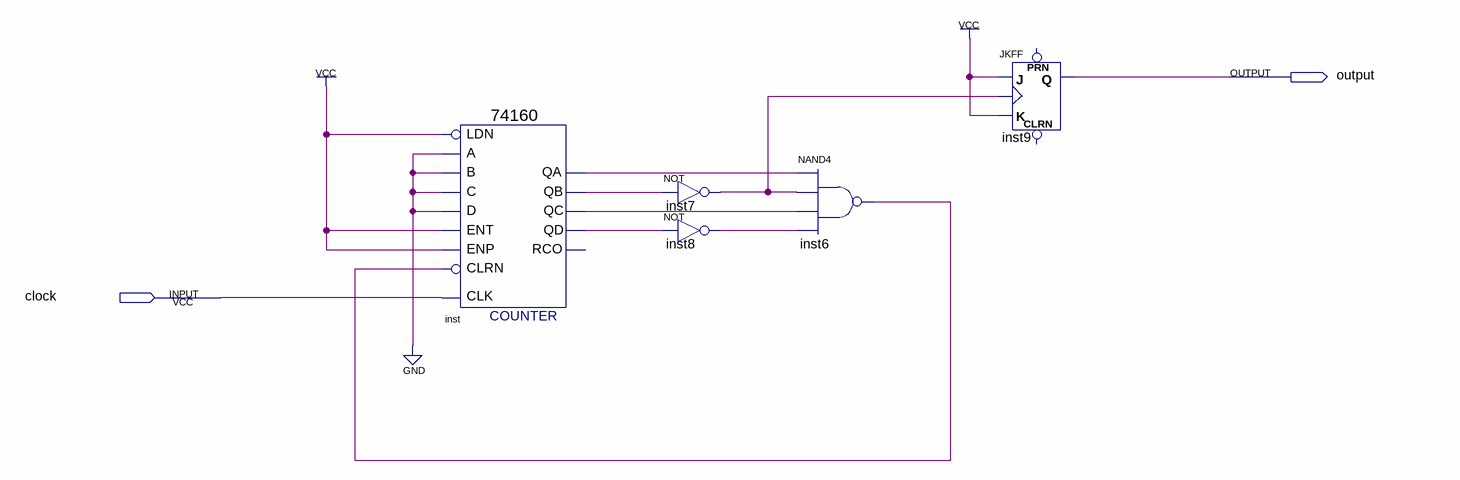
[diagram p0: schematic sheet]
// Quartus schematic fre-divider.bdf as structural Verilog: 5 symbols, 2 pins
module \fre-divider  (
  input  clock,
  output \output 
);

  wire inst6_out, inst7_out, inst8_out, inst_qa, inst_qb, inst_qc, inst_qd;

  \74160  inst (
    .CLK(clock), .ENT(1'b1), .A(1'b0), .B(1'b0), .C(1'b0), .D(1'b0), .LDN(1'b1), .ENP(1'b1),
    .CLRN(inst6_out), .QD(inst_qd), .QA(inst_qa), .QB(inst_qb), .QC(inst_qc));  // open: RCO
  not inst7 (inst7_out, inst_qb);
  not inst8 (inst8_out, inst_qd);
  nand inst6 (inst6_out, inst_qa, inst7_out, inst_qc, inst8_out);
  JKFF inst9 (.K(1'b1), .J(1'b1), .CLK(inst7_out), .Q(\output ));  // open: PRN, CLRN
endmodule
